# Altium project SFCMasterD.PrjPCB (part 2 of 2)

## Sheet drvoutput5.SchDoc
size A4
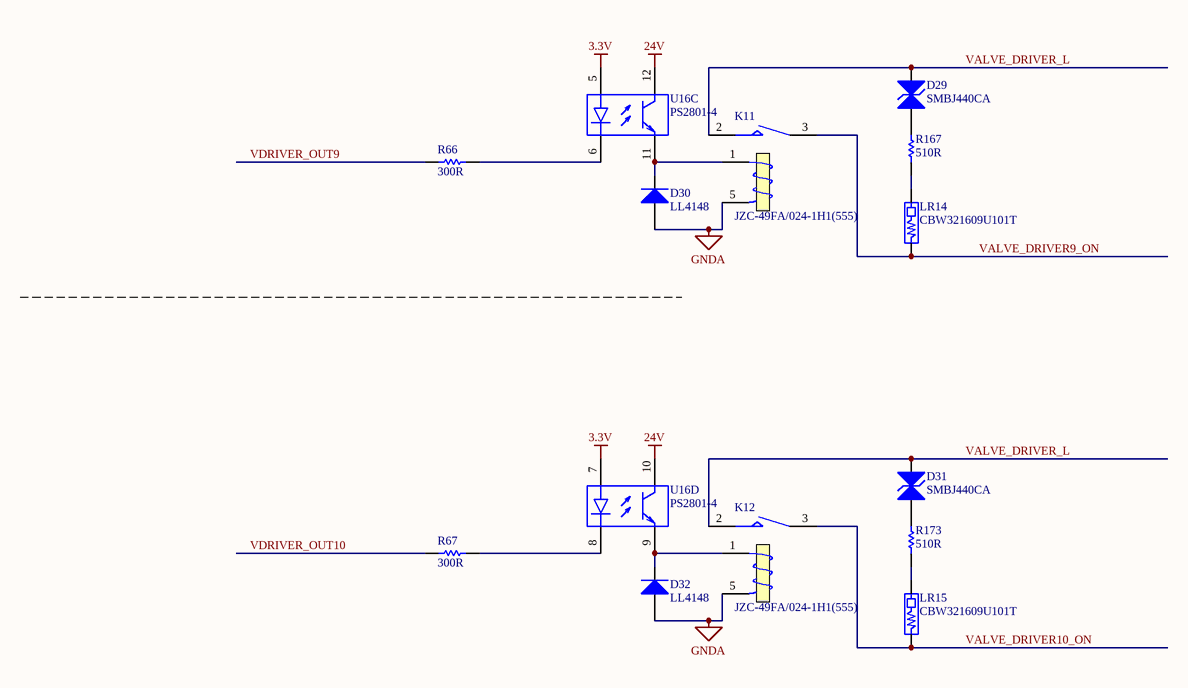
[diagram p16: drvoutput5.SchDoc]

### Parts
D29  SMBJ440CA  [SMB]
D30  LL4148  [CD2012-0805]
D31  SMBJ440CA  [SMB]
D32  LL4148  [CD2012-0805]
K11  JZC-49FA/024-1H1(555)  [JZC-49FA]
K12  JZC-49FA/024-1H1(555)  [JZC-49FA]
LR14  CBW321609U101T  [INDC3216M]
LR15  CBW321609U101T  [INDC3216M]
R66  300R  [RESC2012M]
R67  300R  [RESC2012M]
R167  510R  [RESC3216M]
R173  510R  [RESC3216M]
U16  PS2801-4  [SOIC16_N]  (parts C,D of 4)

### Nets
3.3V: U16.5(+) U16.7(+)
24V: U16.10(C) U16.12(C)
GNDA: D30.1(A) D32.1(A) K11.5(T2) K12.5(T2)
VALVE_DRIVER9_ON: K11.3(NO) LR14.1
VALVE_DRIVER10_ON: K12.3(NO) LR15.1
VALVE_DRIVER_L: D29.2(K) D31.2(K) K11.2(COM) K12.2(COM)
VDRIVER_OUT9: R66.1
VDRIVER_OUT10: R67.1
NetD29_1: D29.1(A) R167.2
NetD30_2: D30.2(K) K11.1 U16.11(E)
NetD31_1: D31.1(A) R173.2
NetD32_2: D32.2(K) K12.1 U16.9(E)
NetLR14_2: LR14.2 R167.1
NetLR15_2: LR15.2 R173.1
NetR66_2: R66.2 U16.6(-)
NetR67_2: R67.2 U16.8(-)

### Library data of the parts
D29 D31 = Bi-dir TVS Diode: Published: 8-Jun-2000; LatestRevisionDate: 17-Jul-2002; LatestRevisionNote: Re-released for DXP Platform.; PackageReference: DIODE-0.7; Publisher: Altium Limited
D30 D32 = Diode 1N4007: 1 Amp General Purpose Rectifier; Published: 8-Jun-2000; LatestRevisionDate: 17-Jul-2002; LatestRevisionNote: Re-released for DXP Platform.; DatasheetVersion: 1998; PackageVersion: Aug-1999; PackageReference: DO-41; Publisher: Altium Limited; Code_JEDEC: DO-204-AL; ComponentLink1Description: Manufacturer Link; ComponentLink1URL: http://www.fairchildsemi.com/; ComponentLink2Description: Datasheet; ComponentLink2URL: http://www.fairchildsemi.com/ds/1N%2F1N4001.pdf
K11 K12 = JZC-49FA: Intermediate  Power  Relay; Published: 8-Jun-2000; LatestRevisionDate: 17-Jul-2002; LatestRevisionNote: Re-released for DXP Platform.; PackageReference: MODULE5B; Publisher: Altium Limited
LR14 LR15 = BLM10/11/21/31/41: EMI FILTERS,DC Resistance max.0.05~1.5 ohms,10 ~ 1000 ohms at 100MHz  Frequency
R66 R67 = Res1: Resistor; Value: 10K; Published: 8-Jun-2000; LatestRevisionDate: 17-Jul-2002; LatestRevisionNote: Re-released for DXP Platform.; PackageReference: AXIAL-0.3; Publisher: Altium Limited
R167 R173 = Res1: Metal film Resistor; Value: 10K; Published: 8-Jun-2000; LatestRevisionDate: 17-Jul-2002; LatestRevisionNote: Re-released for DXP Platform.; PackageReference: AXIAL-0.3; Publisher: Altium Limited
U16 = PS2801-4: The PS2801-1 and PS2801-4 are optically coupled isolators containing a GaAs light emitting diode and an NPN  silicon phototransistor in a plastic SOP for high density applications.; Published: 28-Feb-2003; LatestRevisionDate: 13-Apr-2006; LatestRevisionNote: IPC-7351 Footprint Added.; DatasheetVersion: Jan-2002, Rev. 7; PackageVersion: rev7, Jan-2002; PackageReference: 751-07; Publisher: Altium Limited; PackageDescription: 8-Pin Plastic Small Outline Integrated Circuit 1.27 mm Pitch; Code_JEDEC: MS-012-AA; Code_IPC: SOIC127P600-8; ComponentLink1Description: Manufacturer Link; ComponentLink1URL: http://www.onsemi.com/; ComponentLink2Description: Datasheet; ComponentLink2URL: http://www.onsemi.com/pub/Collateral/LM358-D.PDF

## Nets that join several sheets
3.3V: drvamap (C1.2 C3.2 C36.2 U33.2), drvcomdp (26 pins), drvcomm (5 pins), drveth (7 pins), drvinput0 (6 pins), drvinput1 (5 pins), drvinput2 (R38.1 R39.2 R43.1 R44.2), drvinput3 (5 pins), drvinput4 (R70.1 R71.2 R75.1 R76.2), drvinput5 (5 pins), drvinput6 (R90.1 R91.2 R95.1 R96.2), drvoutput0 (U14.1 U14.3), drvoutput1 (U14.5 U14.7), drvoutput2 (U15.1 U15.3), drvoutput3 (U15.5 U15.7), drvoutput4 (U16.1 U16.3), drvoutput5 (U16.5 U16.7)
5VA: drvamap (P1.2 P4.1 P4.7 P5.6), drvcomm (5 pins)
24V: drvamap (9 pins), drvcomm (J1.7), drvoutput0 (U14.14 U14.16), drvoutput1 (U14.10 U14.12), drvoutput2 (U15.14 U15.16), drvoutput3 (U15.10 U15.12), drvoutput4 (U16.14 U16.16), drvoutput5 (U16.10 U16.12)
FG: drvamap (P5.4), drvcomm (LR1.1)
GND: drvamap (9 pins), drvcomdp (32 pins), drvcomm (8 pins), drveth (15 pins), drvinput0 (R10.2 U5.12 U7.9 U7.11), drvinput1 (U8.12 U9.13 U9.15), drvinput2 (U9.9 U9.11), drvinput3 (U10.12 U11.13 U11.15), drvinput4 (U11.9 U11.11), drvinput5 (U12.12 U13.13 U13.15), drvinput6 (U13.9 U13.11)
GNDA: drvamap (7 pins), drvcomm (11 pins), drveth (CN1.13 CN1.14 LR3.2), drvinput0 (R22.1 R27.1 U7.6 U7.8), drvinput1 (R32.1 R37.1 U9.2 U9.4), drvinput2 (R42.1 R47.1 U9.6 U9.8), drvinput3 (R52.1 R69.1 U11.2 U11.4), drvinput4 (R74.1 R79.1 U11.6 U11.8), drvinput5 (R84.1 R89.1 U13.2 U13.4), drvinput6 (R94.1 R99.1 U13.6 U13.8), drvoutput0 (D10.1 D12.1 K1.5 K2.5), drvoutput1 (D14.1 D16.1 K3.5 K4.5), drvoutput2 (D18.1 D20.1 K5.5 K6.5), drvoutput3 (D22.1 D24.1 K7.5 K8.5), drvoutput4 (D26.1 D28.1 K9.5 K10.5), drvoutput5 (D30.1 D32.1 K11.5 K12.5)
CAN1_RX: drvamap (P1.20), drvcomm (C29.2 R103.2)
CAN1_TX: drvamap (P1.19), drvcomm (C30.2 R104.2)
CANH_PORT: drvamap (P4.4), drvcomm (D33.2 J2.1 R121.1)
CANL_PORT: drvamap (P4.6), drvcomm (D34.2 R110.2 R122.1)
DETECT_IN1: drvamap (P2.4), drvinput1 (R31.1)
DETECT_IN2: drvamap (P2.3), drvinput1 (R36.2)
DETECT_IN3: drvamap (P2.6), drvinput2 (R41.1)
DETECT_IN4: drvamap (P2.5), drvinput2 (R46.2)
DETECT_IN5: drvamap (P2.8), drvinput3 (R51.1)
DETECT_IN6: drvamap (P2.7), drvinput3 (R68.2)
DETECT_IN7: drvamap (P2.10), drvinput4 (R73.1)
DETECT_IN8: drvamap (P2.9), drvinput4 (R78.2)
DETECT_IN9: drvamap (P2.12), drvinput5 (R83.1)
DETECT_IN10: drvamap (P2.11), drvinput5 (R88.2)
DETECT_IN11: drvamap (P2.14), drvinput6 (R93.1)
DETECT_IN12: drvamap (P2.13), drvinput6 (R98.2)
DETECT_PORT1: drvamap (P4.15), drvinput1 (R30.2)
DETECT_PORT2: drvamap (P4.16), drvinput1 (R35.2)
DETECT_PORT3: drvamap (P4.17), drvinput2 (R40.2)
DETECT_PORT4: drvamap (P4.18), drvinput2 (R45.2)
DETECT_PORT5: drvamap (P4.21), drvinput3 (R50.2)
DETECT_PORT6: drvamap (P4.22), drvinput3 (R55.2)
DETECT_PORT7: drvamap (P4.23), drvinput4 (R72.2)
DETECT_PORT8: drvamap (P4.24), drvinput4 (R77.2)
DETECT_PORT9: drvamap (P4.27), drvinput5 (R82.2)
DETECT_PORT10: drvamap (P4.28), drvinput5 (R87.2)
DETECT_PORT11: drvamap (P4.29), drvinput6 (R92.2)
DETECT_PORT12: drvamap (P4.30), drvinput6 (R97.2)
DP_TIM_CAP_IN: drvamap (P2.1), drvinput0 (R14.1)
DP_TIM_CAP_PORT: drvamap (P4.10), drvinput0 (R13.2)
ETH_PHY_MDIO: drvamap (P1.7), drveth (U6.25)
ETH_PHY_RST: drvamap (P1.12), drveth (R102.1 U6.40)
ETH_REF_CLK: drvamap (P1.10), drveth (U6.42)
ETH_RMII_CRS_DV: drvamap (P1.8), drveth (U6.37)
ETH_RMII_MDC: drvamap (P1.9), drveth (U6.24)
ETH_RMII_RXD0: drvamap (P1.5), drveth (U6.29)
ETH_RMII_RXD1: drvamap (P1.6), drveth (U6.28)
ETH_RMII_TX_EN: drvamap (P1.13), drveth (U6.21)
ETH_RMII_TXD0: drvamap (P1.15), drveth (U6.20)
ETH_RMII_TXD1: drvamap (P1.14), drveth (U6.19)
RMT_STARTUP_IN: drvamap (P2.2), drvinput0 (R26.2)
RMT_STARTUP_PORT: drvamap (P4.14), drvinput0 (R25.2)
SHIELD_GND: drvamap (P4.2), drvcomm (J1.1 J1.10 J1.11 LR1.2)
SUB_SYS_BOOTSEL: drvamap (P1.21), drvcomdp (R5.2 U2.60)
SUB_SYS_RST: drvamap (P1.18), drvcomdp (U1.3)
USART_DP_RX: drvamap (P1.16), drvcomdp (U2.42)
USART_DP_TX: drvamap (P1.17), drvcomdp (U2.43)
VALVE_DRIVER1_ON: drvamap (P3.19), drvoutput1 (K3.3 LR6.1)
VALVE_DRIVER2_ON: drvamap (P3.17), drvoutput1 (K4.3 LR7.1)
VALVE_DRIVER3_ON: drvamap (P3.15), drvoutput2 (K5.3 LR8.1)
VALVE_DRIVER4_ON: drvamap (P3.13), drvoutput2 (K6.3 LR9.1)
VALVE_DRIVER5_ON: drvamap (P3.11), drvoutput3 (K7.3 LR10.1)
VALVE_DRIVER6_ON: drvamap (P3.9), drvoutput3 (K8.3 LR11.1)
VALVE_DRIVER7_ON: drvamap (P3.7), drvoutput4 (K9.3 LR12.1)
VALVE_DRIVER8_ON: drvamap (P3.5), drvoutput4 (K10.3 LR13.1)
VALVE_DRIVER9_ON: drvamap (P3.3), drvoutput5 (K11.3 LR14.1)
VALVE_DRIVER10_ON: drvamap (P3.1), drvoutput5 (K12.3 LR15.1)
VALVE_DRIVER_L: drvamap (L2.2), drvoutput0 (D9.2 D11.2 K1.2 K2.2), drvoutput1 (D13.2 D15.2 K3.2 K4.2), drvoutput2 (D17.2 D19.2 K5.2 K6.2), drvoutput3 (D21.2 D23.2 K7.2 K8.2), drvoutput4 (D25.2 D27.2 K9.2 K10.2), drvoutput5 (D29.2 D31.2 K11.2 K12.2)
VDLY_DRIVER: drvamap (P2.28), drvoutput0 (R57.1)
VDRIVER_OUT1: drvamap (P2.25), drvoutput1 (R58.1)
VDRIVER_OUT2: drvamap (P2.26), drvoutput1 (R59.1)
VDRIVER_OUT3: drvamap (P2.23), drvoutput2 (R60.1)
VDRIVER_OUT4: drvamap (P2.24), drvoutput2 (R61.1)
VDRIVER_OUT5: drvamap (P2.21), drvoutput3 (R62.1)
VDRIVER_OUT6: drvamap (P2.22), drvoutput3 (R63.1)
VDRIVER_OUT7: drvamap (P2.19), drvoutput4 (R64.1)
VDRIVER_OUT8: drvamap (P2.17), drvoutput4 (R65.1)
VDRIVER_OUT9: drvamap (P2.16), drvoutput5 (R66.1)
VDRIVER_OUT10: drvamap (P2.15), drvoutput5 (R67.1)
VLV_DLY_DRIVER_ON: drvamap (P3.21), drvoutput0 (K2.3 LR5.1)
VLV_MAIN_DRIVER_ON: drvamap (P3.23), drvoutput0 (K1.3 LR4.1)
VMAIN_DRIVER: drvamap (P2.27), drvoutput0 (R56.1)
VPC3_RTS: drvcomdp (U3.27), drvcomm (R7.2 U4.4 U4.5)
VPC3_RXD: drvcomdp (U3.30), drvcomm (U4.3)
VPC3_TXD: drvcomdp (U3.26), drvcomm (U4.6)
VREF: drvinput0 (R9.2 R10.1 U5.8 U5.10), drvinput1 (U8.4 U8.6), drvinput2 (U8.8 U8.10), drvinput3 (U10.4 U10.6), drvinput4 (U10.8 U10.10), drvinput5 (U12.4 U12.6), drvinput6 (U12.8 U12.10)